# EAGLE schematic Schematic (EAGLE 9.7.0)
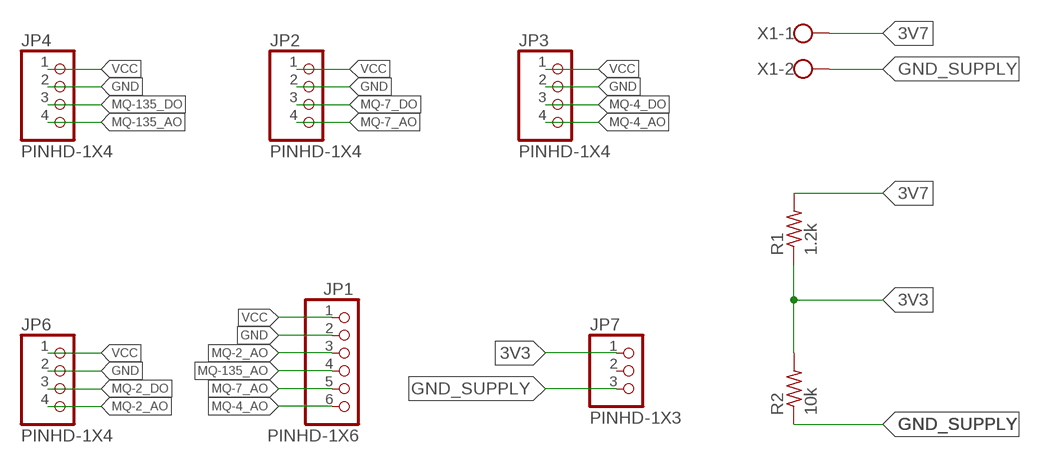
[diagram p0: schematic, sheet 1]

## Parts
JP1  PINHD-1X6  [1X06]
JP2  PINHD-1X4  [1X04]
JP3  PINHD-1X4  [1X04]
JP4  PINHD-1X4  [1X04]
JP6  PINHD-1X4  [1X04]
JP7  PINHD-1X3  [1X03]
R1  1.2k  RESISTOR_SMD_1206  [M1206]
R2  10k  RESISTOR_SMD_1206  [M1206]
X1  W237-102  [W237-102]

## Nets
3V3: JP7.1 R1.1 R2.2
3V7: R1.2 X1.1
GND: JP1.2 JP2.2 JP3.2 JP4.2 JP6.2
GND_SUPPLY: JP7.3 R2.1 X1.2
MQ-2_AO: JP1.3 JP6.4
MQ-2_DO: JP6.3
MQ-4_AO: JP1.6 JP3.4
MQ-4_DO: JP3.3
MQ-7_AO: JP1.5 JP2.4
MQ-7_DO: JP2.3
MQ-135_AO: JP1.4 JP4.4
MQ-135_DO: JP4.3
VCC: JP1.1 JP2.1 JP3.1 JP4.1 JP6.1
Unconnected: JP7.2

## Library data of the parts
JP1 = Connector:PINHD-1X6: PIN HEADER; CATEGORY: CONNECTOR; SUB-CATEGORY: PIN-HEADER
JP2-JP4 JP6 = Connector:PINHD-1X4: PIN HEADER; CATEGORY: CONNECTOR; SUB-CATEGORY: PIN-HEADER
JP7 = Connector:PINHD-1X3: PIN HEADER; CATEGORY: CONNECTOR; SUB-CATEGORY: PIN-HEADER
R1 R2 = BASIC_Components:RESISTOR_SMD_1206
X1 = BASIC_Components:W237-102: WAGO SCREW CLAMP; MPN: 237-102; OC_FARNELL: unknown; OC_NEWARK: 70K9898